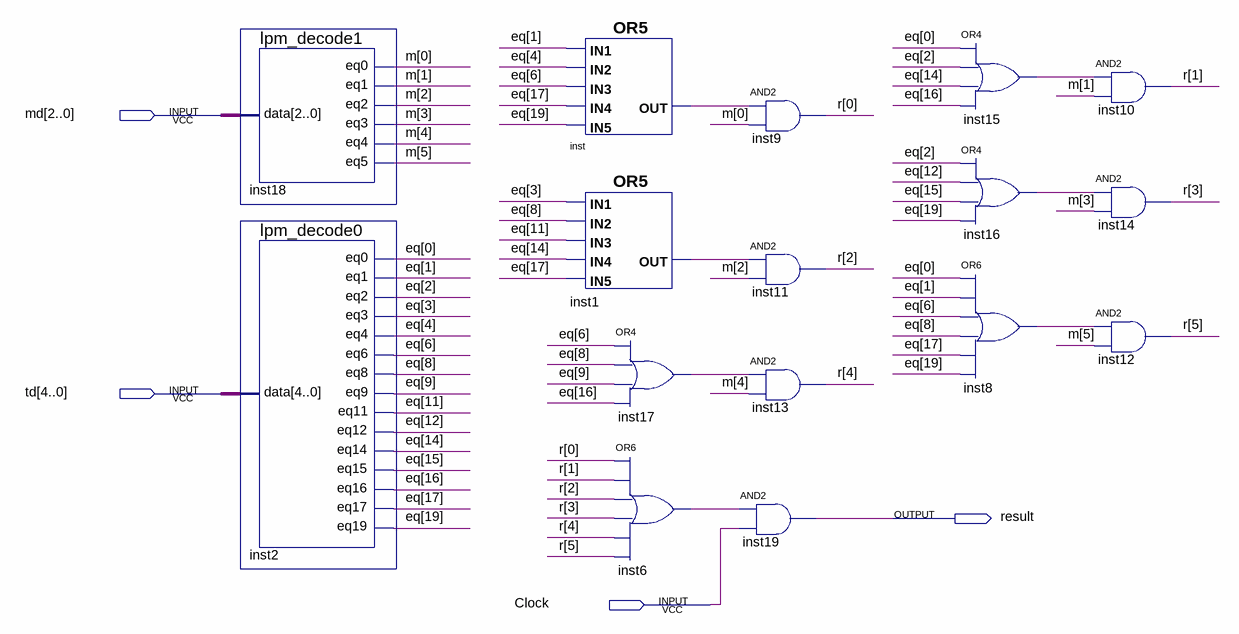
[diagram p0: schematic sheet]
// Quartus schematic decoder.bdf as structural Verilog: 16 symbols, 4 pins
module decoder (
  input  [2:0] md,
  input  [4:0] td,
  input  Clock,
  output result
);

  wire inst1_out, inst6_out, inst8_out, inst15_out, inst16_out, inst17_out, inst_out;
  wire [5:0] m, r;
  wire [19:0] eq;

  lpm_decode1 inst18 (.data(md), .eq0(m[0]), .eq1(m[1]), .eq2(m[2]), .eq3(m[3]), .eq4(m[4]), .eq5(m[5]));
  lpm_decode0 inst2 (
    .data(td), .eq0(eq[0]), .eq1(eq[1]), .eq2(eq[2]), .eq3(eq[3]), .eq4(eq[4]), .eq6(eq[6]), .eq8(eq[8]),
    .eq9(eq[9]), .eq11(eq[11]), .eq12(eq[12]), .eq14(eq[14]), .eq15(eq[15]), .eq16(eq[16]), .eq17(eq[17]),
    .eq19(eq[19]));
  or inst (inst_out, eq[1], eq[4], eq[6], eq[17], eq[19]);
  or inst1 (inst1_out, eq[3], eq[8], eq[11], eq[14], eq[17]);
  or inst17 (inst17_out, eq[6], eq[8], eq[9], eq[16]);
  or inst6 (inst6_out, r[0], r[1], r[2], r[3], r[4], r[5]);
  and inst9 (r[0], inst_out, m[0]);
  and inst11 (r[2], inst1_out, m[2]);
  and inst13 (r[4], inst17_out, m[4]);
  and inst19 (result, inst6_out, Clock);
  or inst15 (inst15_out, eq[0], eq[2], eq[14], eq[16]);
  or inst16 (inst16_out, eq[2], eq[12], eq[15], eq[19]);
  or inst8 (inst8_out, eq[0], eq[1], eq[6], eq[8], eq[17], eq[19]);
  and inst10 (r[1], inst15_out, m[1]);
  and inst14 (r[3], inst16_out, m[3]);
  and inst12 (r[5], inst8_out, m[5]);
endmodule
